# EAGLE design BUZZI-36 (EAGLE 4.15)
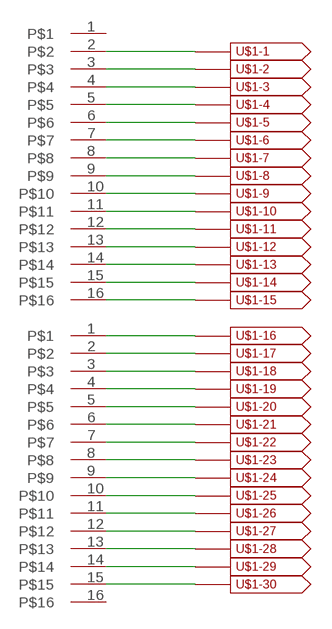
[diagram p0: schematic, sheet 1]

## Parts
A  MA16  [MA16-1]
B  MA16  [MA16-1]
U$1  CONNECTOR30  [HIROSE-FH12-30S-05SH]

## Nets
B: B.1 U$1.P$16
N$1: A.2 U$1.P$1
N$2: A.3 U$1.P$2
N$3: A.4 U$1.P$3
N$4: A.5 U$1.P$4
N$5: A.6 U$1.P$5
N$6: A.7 U$1.P$6
N$7: A.8 U$1.P$7
N$8: A.9 U$1.P$8
N$9: A.10 U$1.P$9
N$10: A.11 U$1.P$10
N$11: A.12 U$1.P$11
N$12: A.13 U$1.P$12
N$13: A.14 U$1.P$13
N$14: A.15 U$1.P$14
N$15: A.16 U$1.P$15
N$17: B.2 U$1.P$17
N$18: B.3 U$1.P$18
N$19: B.4 U$1.P$19
N$20: B.5 U$1.P$20
N$21: B.6 U$1.P$21
N$22: B.7 U$1.P$22
N$23: B.8 U$1.P$23
N$24: B.9 U$1.P$24
N$25: B.10 U$1.P$25
N$26: B.11 U$1.P$26
N$27: B.12 U$1.P$27
N$28: B.13 U$1.P$28
N$29: B.14 U$1.P$29
N$30: B.15 U$1.P$30
Unconnected: A.1 B.16

## Library data of the parts
A B = turbod3:MA16
U$1 = turbod3:CONNECTOR30

## Board
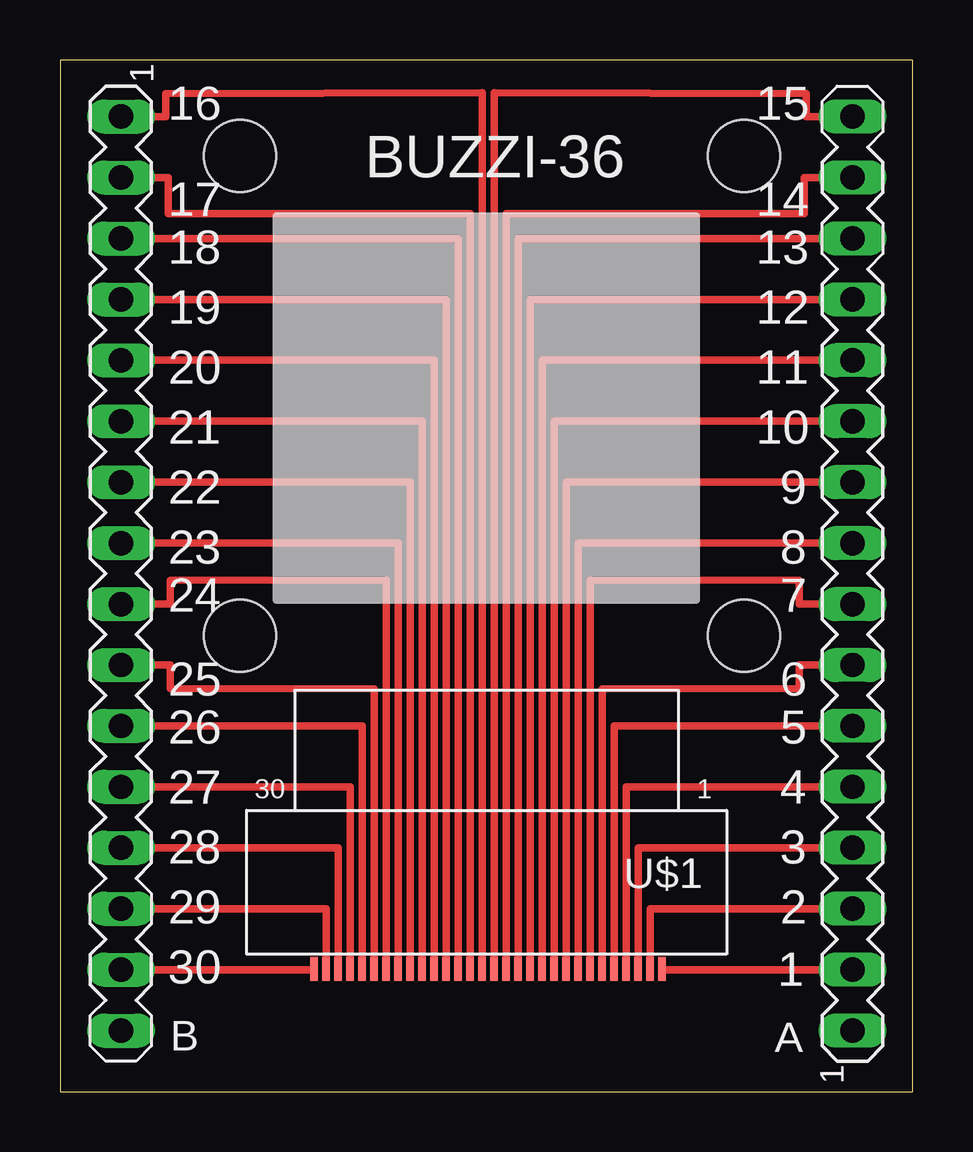
[diagram p1: board, top side]

Size 35.54 x 43 mm. Coordinates in mm from the lower left corner, seen from the top.
Outline: 0,0 35.54,0 35.54,43 0,43 0,0
Copper layers (1*16): Top 0.035mm / dielectric 1.5mm / Bottom 0.035mm
Design rules "PCB-POOL": minimum track width 6mil, minimum drill 12mil, track to track 6mil, track to pad 6mil, pad to pad 6mil, via to via 6mil, smd to smd 6mil, copper to edge 20mil, drill to drill 8mil, minimum pad ring 8mil, minimum via ring 6mil, stop-mask expansion 3mil, vias tented up to drill 0mil, thermal gap 8mil
Holes 3 mm at 7.5,19 28.5,19 7.5,39 28.5,39

### Footprints (pad centres in the part's own frame; a part is rotated, then mirrored left to right if it is on the bottom)
MA16-1 = drill 1.016 long: 1 -17.78,0; 2 -15.24,0; 3 -12.7,0; 4 -10.16,0; 5 -7.62,0; 6 -5.08,0; 7 -2.54,0; 8 0,0; 9 2.54,0; 10 5.08,0; 11 7.62,0; 12 10.16,0; 13 12.7,0; 14 15.24,0; 15 17.78,0; 16 20.32,0
HIROSE-FH12-30S-05SH = smd 0.3 x 1: P$1 -7.3,3.6; P$2 -6.8,3.6; P$3 -6.3,3.6; P$4 -5.8,3.6; P$5 -5.3,3.6; P$6 -4.8,3.6; P$7 -4.3,3.6; P$8 -3.8,3.6; P$9 -3.3,3.6; P$10 -2.8,3.6; P$11 -2.3,3.6; P$12 -1.8,3.6; P$13 -1.3,3.6; P$14 -0.8,3.6; P$15 -0.3,3.6; P$16 0.2,3.6; P$17 0.7,3.6; P$18 1.2,3.6; P$19 1.7,3.6; P$20 2.2,3.6; P$21 2.7,3.6; P$22 3.2,3.6; P$23 3.7,3.6; P$24 4.2,3.6; P$25 4.7,3.6; P$26 5.2,3.6; P$27 5.7,3.6; P$28 6.2,3.6; P$29 6.7,3.6; P$30 7.2,3.6

### Placement (x,y rotation side)
A  33.02,20.32 90 top
B  2.54,22.86 270 top
U$1  17.78,8.72 180 top

### Tracks (layer width: path | path; a pad name or v marks a point on that pad's centre or on a via)
B
  Top 0.305: 17.6,5.1 17.6,5.12 | 17.6,5.12 U$1.P$16 | B.1 4.4,40.64 4.4,41.6 17.6,41.64 17.6,5.12
N$1
  Top 0.305: U$1.P$1 25.1,5.12 25.1,5.08 A.2
N$2
  Top 0.305: 24.6,5.1 24.6,5.12 | 24.6,5.12 U$1.P$2 | A.3 24.6,7.62 24.6,5.12
N$3
  Top 0.305: 24.1,5.1 24.1,5.12 | 24.1,5.12 U$1.P$3 | A.4 24.1,10.16 24.1,5.12
N$4
  Top 0.305: U$1.P$4 23.6,5.12 23.6,12.7 A.5
N$5
  Top 0.305: U$1.P$5 23.1,5.12 23.1,15.24 A.6
N$6
  Top 0.305: U$1.P$6 22.6,5.12 22.6,16.78 30.8,16.8 30.8,17.78 A.7
N$7
  Top 0.305: U$1.P$7 22.1,5.12 22.1,21.32 30.8,21.3 30.8,20.32 A.8
N$8
  Top 0.305: 21.6,5 21.6,5.12 | 21.6,5.12 U$1.P$8 | A.9 21.6,22.86 21.6,5.12
N$9
  Top 0.305: 21.1,5.1 21.1,5.12 | 21.1,5.12 U$1.P$9 | A.10 21.1,25.4 21.1,5.12
N$10
  Top 0.305: 20.6,5 20.6,5.12 | 20.6,5.12 U$1.P$10 | A.11 20.6,27.94 20.6,5.12
N$11
  Top 0.305: U$1.P$11 20.1,5.12 20.1,30.48 A.12
N$12
  Top 0.305: 19.6,5.1 19.6,5.12 | 19.6,5.12 U$1.P$12 | A.13 19.6,33.02 19.6,5.12
N$13
  Top 0.305: 19.1,5.1 19.1,5.12 | 19.1,5.12 U$1.P$13 | A.14 19.1,35.56 19.1,5.12
N$14
  Top 0.305: 18.6,5.1 18.6,5.12 | 18.6,5.12 U$1.P$14 | A.15 31,38.1 31,36.6 18.6,36.6 18.6,5.12
N$15
  Top 0.305: 18.1,5 18.1,5.12 | 18.1,5.12 U$1.P$15 | A.16 31.1,40.64 31.1,41.6 18.1,41.64 18.1,5.12
N$17
  Top 0.305: 17.1,5.1 17.1,5.12 | 17.1,5.12 U$1.P$17 | B.2 4.5,38.1 4.5,36.6 17.1,36.6 17.1,5.12
N$18
  Top 0.305: 16.6,5 16.6,5.12 | 16.6,5.12 U$1.P$18 | B.3 16.6,35.56 16.6,5.12
N$19
  Top 0.305: 16.1,5.1 16.1,5.12 | 16.1,5.12 U$1.P$19 | B.4 16.1,33.02 16.1,5.12
N$20
  Top 0.305: 15.6,5.1 15.6,5.12 | 15.6,5.12 U$1.P$20 | B.5 15.6,30.48 15.6,5.12
N$21
  Top 0.305: 15.1,5.1 15.1,5.12 | 15.1,5.12 U$1.P$21 | B.6 15.1,27.94 15.1,5.12
N$22
  Top 0.305: U$1.P$22 14.6,5.12 14.6,25.4 B.7
N$23
  Top 0.305: 14.1,5.1 14.1,5.12 | 14.1,5.12 U$1.P$23 | B.8 14.1,22.86 14.1,5.12
N$24
  Top 0.305: U$1.P$24 13.6,5.12 13.6,21.32 4.6,21.3 4.6,20.32 B.9
N$25
  Top 0.305: U$1.P$25 13.1,5.12 13.1,16.78 4.6,16.8 4.6,17.78 B.10
N$26
  Top 0.305: U$1.P$26 12.6,5.12 12.6,15.24 B.11
N$27
  Top 0.305: 12.1,5.1 12.1,5.12 | 12.1,5.12 U$1.P$27 | B.12 12.1,12.7 12.1,5.12
N$28
  Top 0.305: U$1.P$28 11.6,5.12 11.6,10.16 B.13
N$29
  Top 0.305: 11.1,5 11.1,5.12 | 11.1,5.12 U$1.P$29 | B.14 11.1,7.62 11.1,5.12
N$30
  Top 0.305: U$1.P$30 10.6,5.12 10.6,5.08 B.15

### Text on the board
tPlace: BUZZI-36
tNames: 16 | 15 | 17 | 14 | 18 | 13 | 19 | 12 | 20 | 11 | 21 | 10 | 22 | 9 | 23 | 8 | 24 | 7 | 25 | 6 | 26 | 5 | 27 | 4 | 28 | 3 | 29 | 2 | 30 | 1